# Altium project Mach cau H.PrjPCB
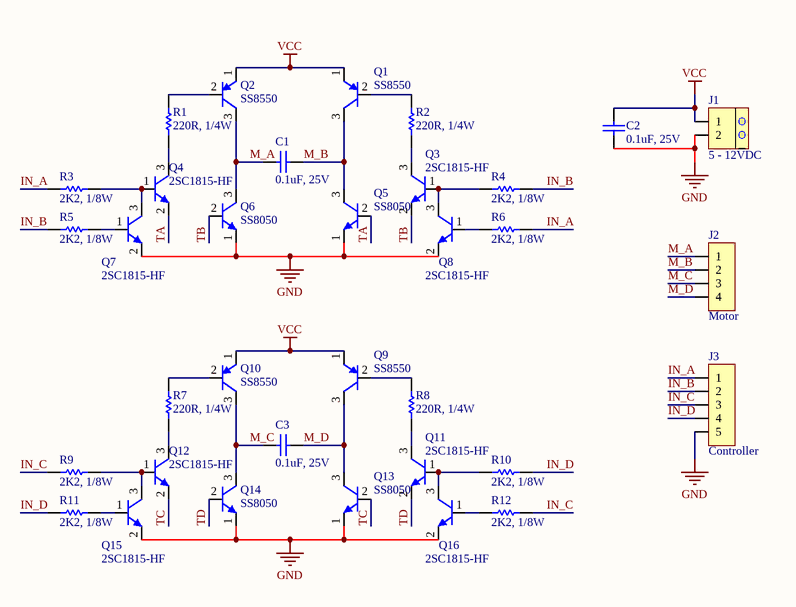
[diagram p0: H bridge circuit.SchDoc]
1 sheet, 34 parts. Net scope: global (net labels, ports and power ports of the same name join across sheets).
Board file: H bridge circuit.PcbDoc

## Sheet H bridge circuit.SchDoc: Bài 2: Mạch cầu H
size A4; Organization: Altium Limited; Address1: DĐ; Address2: Frenchs Forest; Address3: NSW; Address4: Australia 2086; Revision: 1; SheetNumber: 1; SheetTotal: 1

### Parts
C1  value 0.1uF, 25V  [C0_1uF]  (hidden comment: 5WF104MABAA)
C2  value 0.1uF, 25V  [C0_1uF]  (hidden comment: 5WF104MABAA)
C3  value 0.1uF, 25V  [C0_1uF]  (hidden comment: 5WF104MABAA)
J1  value 5 - 12VDC  [CON2]  (hidden comment: OSTTC-02-2162)
J2  value Motor  [Header_4]  (hidden comment: 2012-254-1x04-SG)
J3  value Controller  [Header_5]  (hidden comment: 2012-254-1x05-SG)
Q1  SS8550  [SS8550]
Q2  SS8550  [SS8550]
Q3  2SC1815-HF  [2SC1815-HF]
Q4  2SC1815-HF  [2SC1815-HF]
Q5  SS8050  [SS8050]
Q6  SS8050  [SS8050]
Q7  2SC1815-HF  [2SC1815-HF]
Q8  2SC1815-HF  [2SC1815-HF]
Q9  SS8550  [SS8550]
Q10  SS8550  [SS8550]
Q11  2SC1815-HF  [2SC1815-HF]
Q12  2SC1815-HF  [2SC1815-HF]
Q13  SS8050  [SS8050]
Q14  SS8050  [SS8050]
Q15  2SC1815-HF  [2SC1815-HF]
Q16  2SC1815-HF  [2SC1815-HF]
R1  value 220R, 1/4W  [RESC2012L]  (hidden comment: CF1/4W220RJ25)
R2  value 220R, 1/4W  [RESC2012L]  (hidden comment: CF1/4W220RJ25)
R3  value 2K2, 1/8W  [RESC2012L]  (hidden comment: CR05JL7-2K2)
R4  value 2K2, 1/8W  [RESC2012L]  (hidden comment: CR05JL7-2K2)
R5  value 2K2, 1/8W  [RESC2012L]  (hidden comment: CR05JL7-2K2)
R6  value 2K2, 1/8W  [RESC2012L]  (hidden comment: CR05JL7-2K2)
R7  value 220R, 1/4W  [RESC2012L]  (hidden comment: CF1/4W220RJ25)
R8  value 220R, 1/4W  [RESC2012L]  (hidden comment: CF1/4W220RJ25)
R9  value 2K2, 1/8W  [RESC2012L]  (hidden comment: CR05JL7-2K2)
R10  value 2K2, 1/8W  [RESC2012L]  (hidden comment: CR05JL7-2K2)
R11  value 2K2, 1/8W  [RESC2012L]  (hidden comment: CR05JL7-2K2)
R12  value 2K2, 1/8W  [RESC2012L]  (hidden comment: CR05JL7-2K2)

### Nets
GND: C2.1 J1.2 J3.5 Q5.1(E) Q6.1(E) Q7.2(E) Q8.2(E) Q13.1(E) Q14.1(E) Q15.2(E) Q16.2(E)
VCC: C2.2 J1.1 Q1.1(E) Q2.1(E) Q9.1(E) Q10.1(E)
IN_A: J3.1 R3.1 R6.2
IN_B: J3.2 R4.2 R5.1
IN_C: J3.3 R9.1 R12.2
IN_D: J3.4 R10.2 R11.1
M_A: C1.1 J2.1 Q2.3(C) Q6.3(C)
M_B: C1.2 J2.2 Q1.3(C) Q5.3(C)
M_C: C3.1 J2.3 Q10.3(C) Q14.3(C)
M_D: C3.2 J2.4 Q9.3(C) Q13.3(C)
TA: Q4.2(E) Q5.2(B)
TB: Q3.2(E) Q6.2(B)
TC: Q12.2(E) Q13.2(B)
TD: Q11.2(E) Q14.2(B)
NetQ1_2: Q1.2(B) R2.2
NetQ2_2: Q2.2(B) R1.2
NetQ3_1: Q3.1(B) Q8.3(C) R4.1
NetQ3_3: Q3.3(C) R2.1
NetQ4_1: Q4.1(B) Q7.3(C) R3.2
NetQ4_3: Q4.3(C) R1.1
NetQ7_1: Q7.1(B) R5.2
NetQ8_1: Q8.1(B) R6.1
NetQ9_2: Q9.2(B) R8.2
NetQ10_2: Q10.2(B) R7.2
NetQ11_1: Q11.1(B) Q16.3(C) R10.1
NetQ11_3: Q11.3(C) R8.1
NetQ12_1: Q12.1(B) Q15.3(C) R9.2
NetQ12_3: Q12.3(C) R7.1
NetQ15_1: Q15.1(B) R11.2
NetQ16_1: Q16.1(B) R12.1

### Notes on the sheet
- Title
- Size:
- Date:
- A4
- Number:
- Time:
- Revision:
- Sheet
- of
- LẠI PHƯỚC SƠN
- elec2pcb@gmail.com
- elec2pcb.com
- File:

### Library data of the parts
C1-C3 = 5WF104MABAA: CAP Y5P CAPNTO 0.1uF 25V 20%; ComponentLink1Description: Datasheet; ComponentLink1URL: D:\Dropbox\Datasheets\Passive Components\Capacitors\AVX Disc Ceramic Capacitors.pdf; Unit Price: 0.003
J1 = OSTTC-02-2162: Terminal Block 2 Poles 5.08mm Blue; ComponentLink1Description: Datasheet; ComponentLink1URL: D:\Dropbox\Datasheets\Passive Components\Connectors\OSTTC-XX-2162.pdf; Unit Price: 0.076
J2 = 2012-254-1x04-SG: Male Header 04 Pin 2.54mm Straight; ComponentLink1Description: Datasheet; ComponentLink1URL: D:\Dropbox\Datasheets\Passive Components\Connectors\2012-254-1xXX-SG.pdf; Unit Price: 0.032
J3 = 2012-254-1x05-SG: Male Header 05 Pin 2.54mm Straight; ComponentLink1Description: Datasheet; ComponentLink1URL: D:\Dropbox\Datasheets\Passive Components\Connectors\2012-254-1xXX-SG.pdf; Unit Price: 0.032
Q1 Q2 Q9 Q10 = SS8550: Trans PNP -25V -1.5A TO-92; ComponentLink1Description: Datasheet; ComponentLink1URL: D:\Dropbox\Datasheets\Transistors\N Channel Bipolar\SS8550.pdf; Unit Price: 0.0476
Q3 Q4 Q7 Q8 Q11 Q12 Q15 Q16 = 2SC1815-HF: Trans NPN 50V 150mA SOT-23; ComponentLink1Description: Datasheet; ComponentLink1URL: D:\Dropbox\Datasheets\Transistors\P Channel Bipolar\2SC1815-HF.pdf; Unit Price: 0.0286
Q5 Q6 Q13 Q14 = SS8050: Trans NPN 25V 1.5A TO-92; ComponentLink1Description: Datasheet; ComponentLink1URL: D:\Dropbox\Datasheets\Transistors\P Channel Bipolar\SS8050.pdf; Unit Price: 0.0476
R1 R2 R7 R8 = CF1/4W220RJ25: RES CF AXIAL-0.3 5% 1/4W 220R; Unit Price: 0.001; ComponentLink1Description: Datasheet; ComponentLink1URL: D:\Dropbox\Datasheets\Passive Components\Resistors\Carbon Film Resistor.pdf
R3-R6 R9-R12 = CR05JL7-2K2: RES CR 0805 5% 1/8W 2K2; Unit Price: 0.000802; ComponentLink1Description: Datasheet; ComponentLink1URL: D:\Dropbox\Datasheets\Passive Components\Resistors\Thick Film Chip Resistor CR.pdf